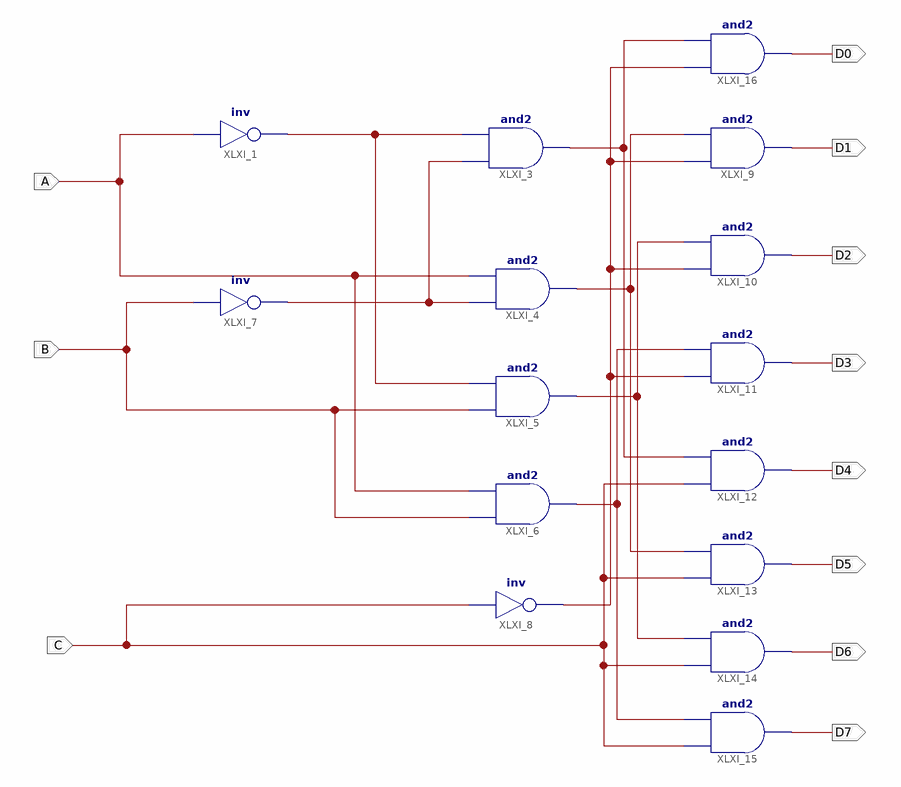
[diagram p0: schematic sheet 1]
// Xilinx ISE schematic Decoder_38_sch.sch (kintex7) as structural Verilog: 15 symbols, 11 ports
module Decoder_38_sch (
  input  A,
  input  B,
  input  C,
  output D0,
  output D1,
  output D2,
  output D3,
  output D4,
  output D5,
  output D6,
  output D7
);

  wire XLXN_2, XLXN_4, XLXN_12, XLXN_14, XLXN_16, XLXN_18, XLXN_21;

  not XLXI_1 (XLXN_2, A);
  and XLXI_3 (XLXN_12, XLXN_4, XLXN_2);
  and XLXI_4 (XLXN_14, XLXN_4, A);
  and XLXI_5 (XLXN_16, B, XLXN_2);
  and XLXI_6 (XLXN_18, B, A);
  not XLXI_7 (XLXN_4, B);
  not XLXI_8 (XLXN_21, C);
  and XLXI_9 (D1, XLXN_21, XLXN_14);
  and XLXI_10 (D2, XLXN_21, XLXN_16);
  and XLXI_11 (D3, XLXN_21, XLXN_18);
  and XLXI_12 (D4, C, XLXN_12);
  and XLXI_13 (D5, C, XLXN_14);
  and XLXI_14 (D6, C, XLXN_16);
  and XLXI_15 (D7, C, XLXN_18);
  and XLXI_16 (D0, XLXN_21, XLXN_12);
endmodule
